# EAGLE design PulsePalSMT_Rev_0_8 (EAGLE 7.7.0)
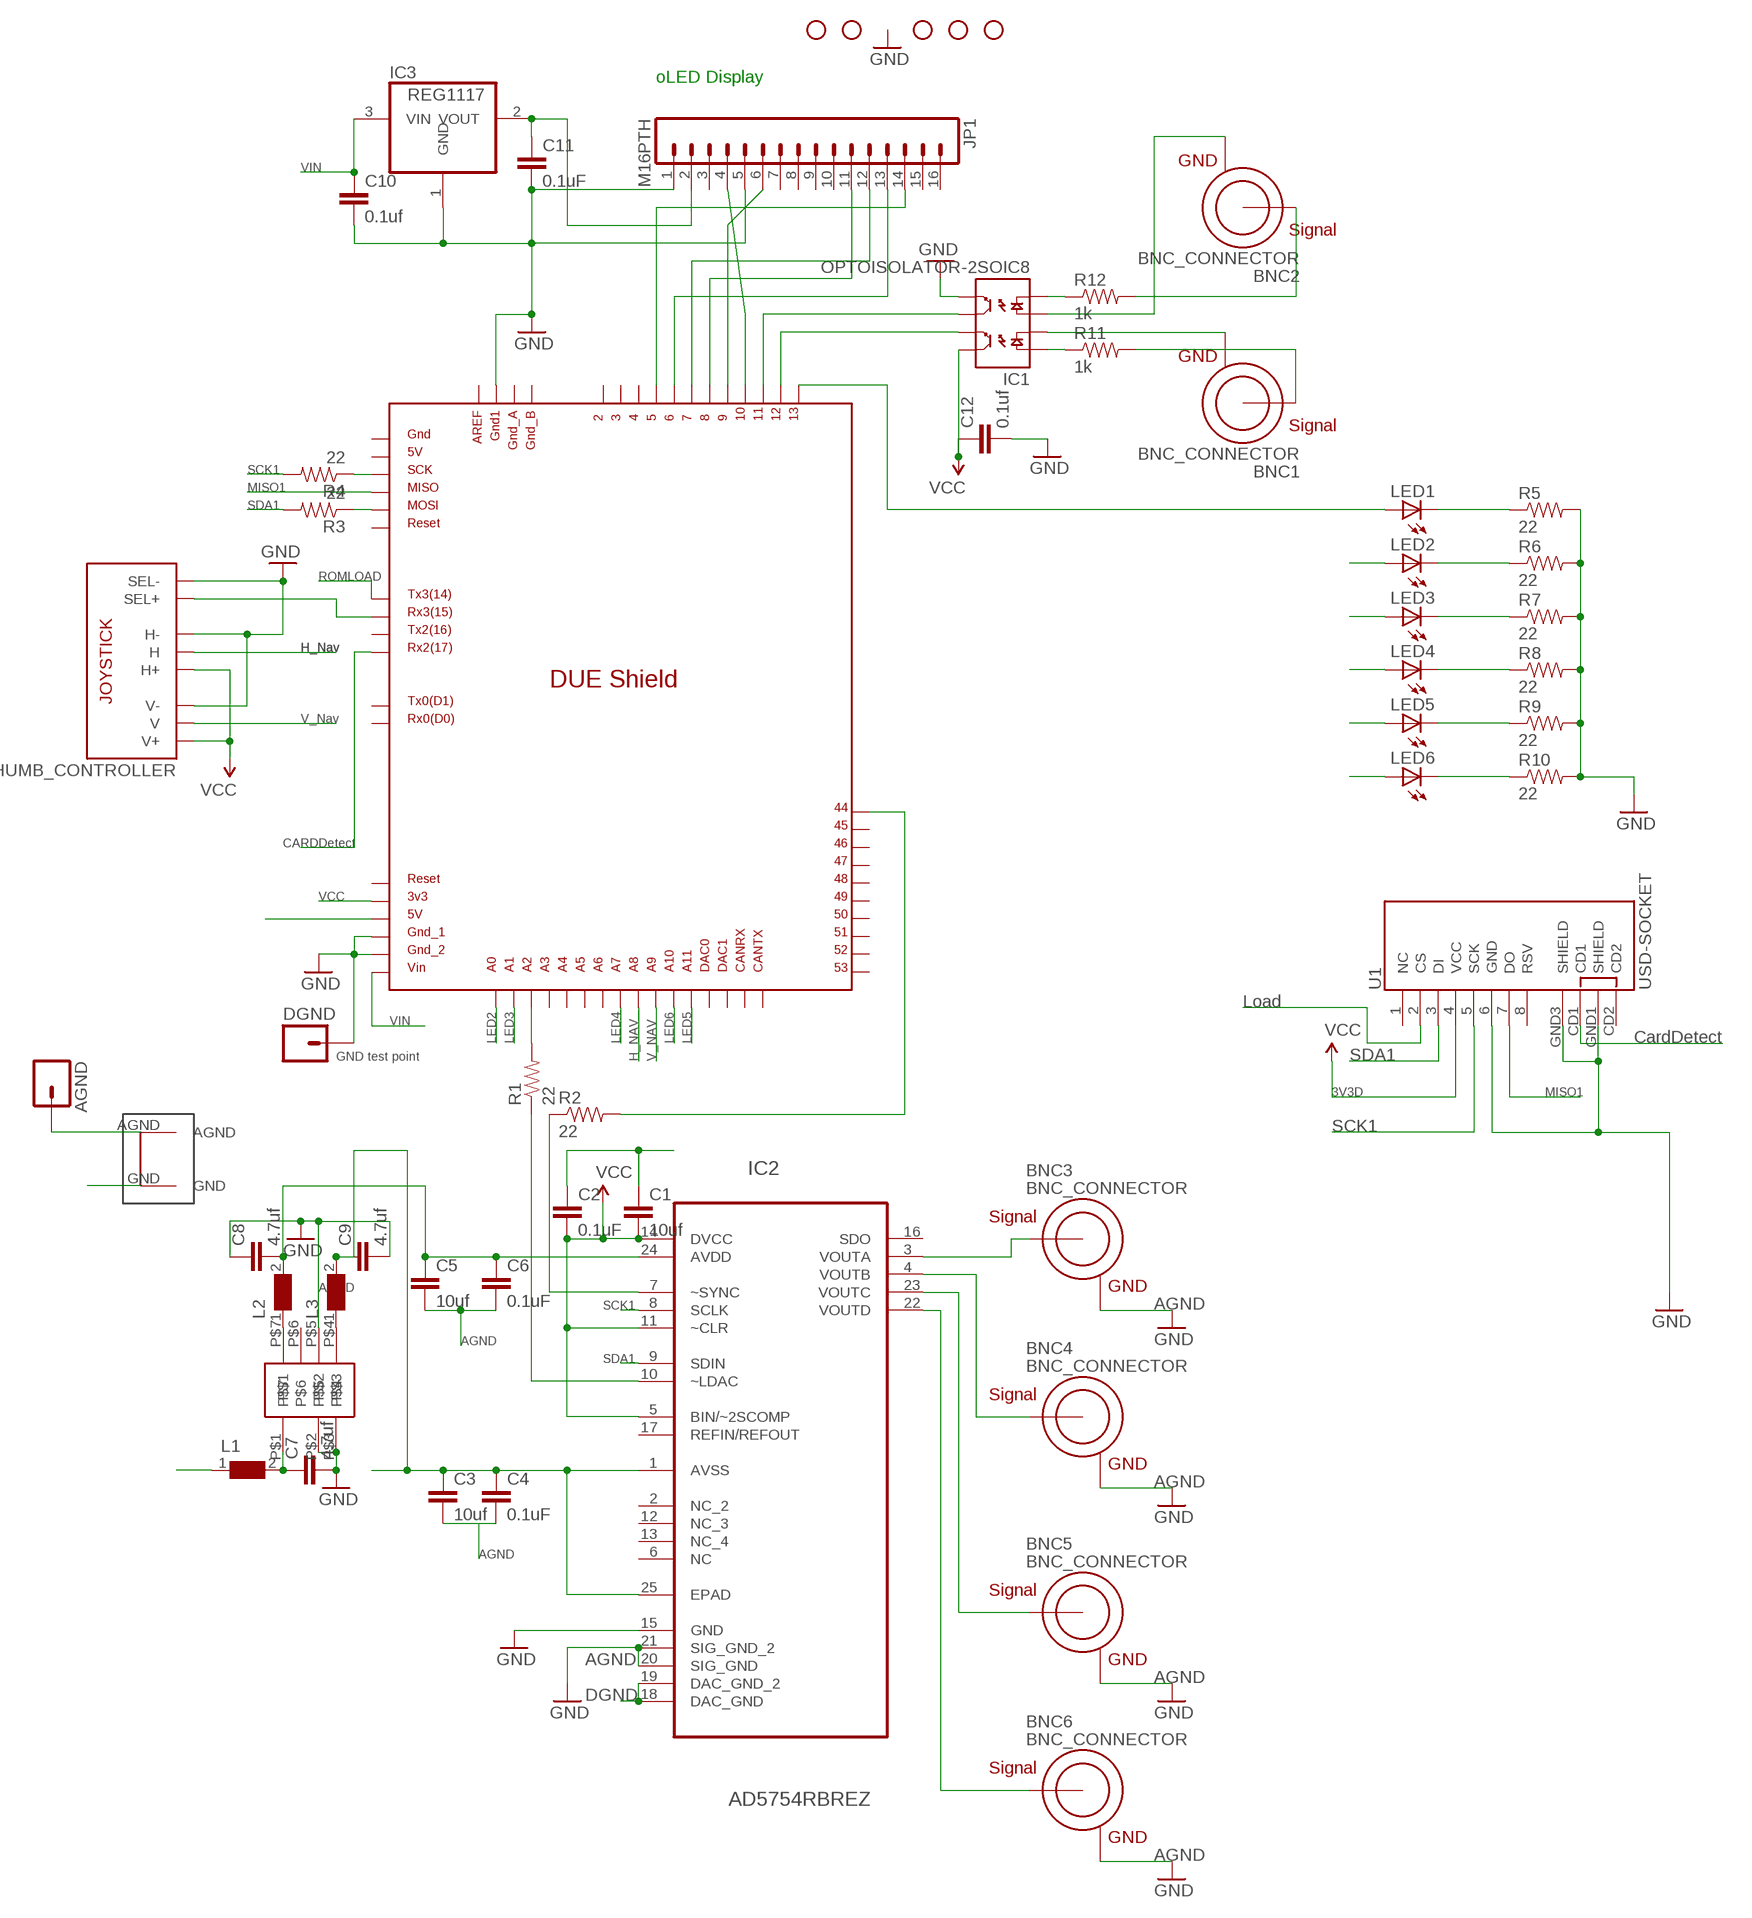
[diagram p0: schematic, sheet 1]

## Parts
AGND  M01PTH  [1X01]
ARDUINO  DUE(NORMAL)  [DUE(NORMAL)]
BNC1  BNC_CONNECTOR  [BNC_CONNECTOR]
BNC2  BNC_CONNECTOR  [BNC_CONNECTOR]
BNC3  BNC_CONNECTOR  [BNC_CONNECTOR]
BNC4  BNC_CONNECTOR  [BNC_CONNECTOR]
BNC5  BNC_CONNECTOR  [BNC_CONNECTOR]
BNC6  BNC_CONNECTOR  [BNC_CONNECTOR]
C1  10uf  CAP1206  [1206@1]
C2  0.1uF  1.0UF-0805-25V-10%  [0805]
C3  10uf  CAP1206  [1206@1]
C4  0.1uF  1.0UF-0805-25V-10%  [0805]
C5  10uf  CAP1206  [1206@1]
C6  0.1uF  1.0UF-0805-25V-10%  [0805]
C7  4.7uf  CAP1206  [1206@1]
C8  4.7uf  CAP1206  [1206@1]
C9  4.7uf  CAP1206  [1206@1]
C10  0.1uf  1.0UF-0805-25V-10%  [0805]
C11  0.1uF  1.0UF-0805-25V-10%  [0805]
C12  0.1uf  CAP1206  [1206@1]
DGND  M01PTH  [1X01]
IC1  OPTOISOLATOR-2SOIC8  [SO08-2]
IC2  AD5754RBREZ  [SOP65P640X120-25N]
IC3  REG1117  [SOT223]
JP1  M16PTH  [1X16]
JP2  STAND-OFF  [STAND-OFF]
JP5  STAND-OFF  [STAND-OFF]
JP6  STAND-OFF  [STAND-OFF]
JP8  STAND-OFF  [STAND-OFF]
JP9  STAND-OFF  [STAND-OFF]
L1  WE-CBF-742792118_1206  [1206]
L2  WE-CBF-742792118_1206  [1206]
L3  WE-CBF-742792118_1206  [1206]
LED1  LEDCHIPLED_1206  [CHIPLED_1206]
LED2  LEDCHIPLED_1206  [CHIPLED_1206]
LED3  LEDCHIPLED_1206  [CHIPLED_1206]
LED4  LEDCHIPLED_1206  [CHIPLED_1206]
LED5  LEDCHIPLED_1206  [CHIPLED_1206]
LED6  LEDCHIPLED_1206  [CHIPLED_1206]
R1  22  RESISTOR1206  [1206]
R2  22  RESISTOR1206  [1206]
R3  22  RESISTOR1206  [1206]
R4  22  RESISTOR1206  [1206]
R5  22  RESISTOR1206  [1206]
R6  22  RESISTOR1206  [1206]
R7  22  RESISTOR1206  [1206]
R8  22  RESISTOR1206  [1206]
R9  22  RESISTOR1206  [1206]
R10  22  RESISTOR1206  [1206]
R11  1k  RESISTOR1206  [1206]
R12  1k  RESISTOR1206  [1206]
THUMB_CONTROLLER  JOYSTICKPTH  [JOYSTICK]
U1  USD-SOCKET  [MICROSD_1:1]
U2  TDK_LAMBDA_5_TO_BI_12_125MA  [TDK_LAMBDA_5_TO_BI_12_125MA]
U$6  GNDPLANESHRT  [GNDPLANESHRT]

## Nets
5V: ARDUINO.5V C1.2 C2.2 IC2.5(BIN/~2SCOMP) IC2.11(~CLR) IC2.14(DVCC) L1.1 ; supply symbol labelled VCC
AGND: AGND.1 BNC3.GND BNC4.GND BNC5.GND BNC6.GND C3.2 C4.2 C5.2 C6.2 IC2.15(GND) IC2.18(DAC_GND) IC2.19(DAC_GND_2) IC2.20(SIG_GND) IC2.21(SIG_GND_2) U$6.AGND ; supply symbol labelled GND
CARDDETECT: ARDUINO.RX2 U1.CD1
GND: ARDUINO.GND1 ARDUINO.GND_1 ARDUINO.GND_2 C1.1 C2.1 C7.2 C8.1 C9.2 C10.2 C11.2 C12.2 DGND.1 IC1.5(EM2) IC3.1(GND) JP1.1 JP1.5 R5.2 R6.2 R7.2 R8.2 R9.2 R10.2 THUMB_CONTROLLER.B2A(SEL-) THUMB_CONTROLLER.H3(H-) THUMB_CONTROLLER.V3(V-) U1.6(GND) U1.GND1(SHIELD) U1.GND3(SHIELD) U2.P$2 U2.P$3 U2.P$5 U$6.GND
H_NAV: ARDUINO.A8 THUMB_CONTROLLER.H2(H)
LED2: ARDUINO.A0 LED2.A
LED3: ARDUINO.A1 LED3.A
LED4: ARDUINO.A7 LED4.A
LED5: ARDUINO.A11 LED5.A
LED6: ARDUINO.A10 LED6.A
MISO1: ARDUINO.MISO_ICSP U1.7(DO)
N$1: L2.1 U2.P$7
N$2: L3.1 U2.P$4
N$3: BNC3.SIGNAL IC2.3(VOUTA)
N$4: BNC4.SIGNAL IC2.4(VOUTB)
N$5: BNC5.SIGNAL IC2.23(VOUTC)
N$6: BNC6.SIGNAL IC2.22(VOUTD)
N$7: BNC1.GND IC1.2(C1)
N$8: BNC1.SIGNAL R11.2
N$9: BNC2.GND IC1.3(A2)
N$10: BNC2.SIGNAL R12.2
N$11: ARDUINO.SCK_ICSP R4.1
N$12: ARDUINO.MOSI_ICSP R3.1
N$13: ARDUINO.44 R2.2
N$14: ARDUINO.A2 R1.2
N$15: IC2.7(~SYNC) R2.1
N$16: IC2.10(~LDAC) R1.1
N$17: ARDUINO.RX3 THUMB_CONTROLLER.B1A(SEL+)
N$18: ARDUINO.11 IC1.6(CL2)
N$20: C11.1 IC3.2(VOUT) JP1.2
N$21: LED1.C R5.1
N$22: LED2.C R6.1
N$23: LED3.C R7.1
N$24: LED4.C R8.1
N$25: LED5.C R9.1
N$26: LED6.C R10.1
N$27: IC1.1(A1) R11.1
N$28: IC1.4(C2) R12.1
N$29: ARDUINO.12 IC1.7(EM1)
N$30: ARDUINO.5 JP1.14
N$31: ARDUINO.13 LED1.A
N$32: ARDUINO.10 JP1.4
N$33: ARDUINO.9 JP1.6
N$34: ARDUINO.8 JP1.11
N$35: ARDUINO.7 JP1.12
N$36: ARDUINO.6 JP1.13
N$39: C5.1 C6.1 C8.2 IC2.24(AVDD) L2.2
N$40: C3.1 C4.1 C9.1 IC2.1(AVSS) IC2.25(EPAD) L3.2
N$41: C7.1 L1.2 U2.P$1
ROMLOAD: ARDUINO.TX3 U1.2(CS)
SCK1: IC2.8(SCLK) R4.2 U1.5(SCK)
SDA1: IC2.9(SDIN) R3.2 U1.3(DI)
V_NAV: ARDUINO.A9 THUMB_CONTROLLER.V2(V)
VCC: ARDUINO.3V3 C12.1 IC1.8(CL1) THUMB_CONTROLLER.H1(H+) THUMB_CONTROLLER.V1(V+) U1.4(VCC)
VIN: ARDUINO.VIN C10.1 IC3.3(VIN)
Unconnected: ARDUINO.2 ARDUINO.3 ARDUINO.4 ARDUINO.5V_ICSP ARDUINO.45 ARDUINO.46 ARDUINO.47 ARDUINO.48 ARDUINO.49 ARDUINO.50 ARDUINO.51 ARDUINO.52 ARDUINO.53 ARDUINO.A3 ARDUINO.A4 ARDUINO.A5 ARDUINO.A6 ARDUINO.AREF ARDUINO.CANRX ARDUINO.CANTX ARDUINO.DAC0 ARDUINO.DAC1 ARDUINO.GND_A ARDUINO.GND_B ARDUINO.GND_ICSP ARDUINO.RESET ARDUINO.RESET_ICSP ARDUINO.RX0 ARDUINO.TX0 ARDUINO.TX2 IC2.2(NC_2) IC2.6(NC) IC2.12(NC_3) IC2.13(NC_4) IC2.16(SDO) IC2.17(REFIN/REFOUT) JP1.3 JP1.7 JP1.8 JP1.9 JP1.10 JP1.15 JP1.16 U1.1(NC) U1.8(RSV) U1.CD2 U2.P$6

## Notes on the sheet
- oLED Display
- VIN
- SCK1
- MISO1
- SDA1
- ROMLOAD
- H_Nav | H_Nav
- V_Nav
- CARDDetect
- VCC
- Load
- VIN
- LED2 | LED3 | LED4 | LED6 | LED5 | CardDetect
- GND test point | H_NAV | V_NAV | SDA1
- 3V3D | MISO1
- SCK1
- AGND
- SCK1 | AGND
- AGND
- SDA1
- AGND
- AGND
- AGND
- AGND
- DGND
- AGND

## Library data of the parts
AGND DGND = SparkFun-Connectors:M01: Header 1 Standard 1-pin 0.1" header. Use with straight break away headers (SKU : PRT-00116), right angle break away headers (PRT-00553), swiss pins (PRT-00743), machine pins (PRT-00117), and female headers (PRT-00115).
ARDUINO = DUElib130425_JS2:DUE(NORMAL)
BNC1-BNC6 = JoshParts:BNC_CONNECTOR
C1 C3 C5 C7-C9 C12 = SparkFun-Capacitors:CAP: Capacitor Standard 0603 ceramic capacitor, and 0.1" leaded capacitor.
C2 C4 C6 C10 C11 = SparkFun-Capacitors:1.0UF: 1µF ceramic capacitors A capacitor is a passive two-terminal electrical component used to store electrical energy temporarily in an electric field.; PROD_ID: CAP-08064; VALUE: 1.0uF
IC1 = SparkFun-DiscreteSemi:OPTOISOLATOR-2: Description: Dual gate opto isolator. Vishay part : ILD213T; PROD_ID: IC-09076
IC2 = Analog Devices_By_element14_Batch_1:AD5754RBREZ: DAC; MPN: AD5754RBREZ; OC_FARNELL: 1786050; OC_NEWARK: 51P3755; PACKAGE: TSSOP-24; SUPPLIER: Analog Devices
IC3 = burr-brown:REG1117: 800mA and 1A Low Dropout (LDO) Positive Regulator 1.8V, 2.5V, 2.85V, 3.3V, 5V, and Adj; MPN: REG1117; OC_FARNELL: 1097566; OC_NEWARK: 14P6981
JP1 = SparkFun:M16
JP2 JP5 JP6 JP8 JP9 = SparkFun:STAND-OFF: Stand Off This is the mechanical footprint for a #4 phillips button head screw. Use the keepout ring to avoid running the screw head into surrounding components. SKU : PRT-00447
L1-L3 = WE-CBF:WE-CBF: SMD EMI Suppression Ferrite Beads WE-CBF - Excellent anti-EMI properties - Low DC-restistance - Impedances till 3000 ohms - Rated current up to 6 A -- Reliable Ni-Sn electrodes -- Perfect as data lined filter and for uncoupling of distribution voltage; MPN: 742792118; OC_FARNELL: 1800374; OC_NEWARK: 78R5648; PACKAGE: IND-1206; SUPPLIER: Wuerth Elektronik
LED1-LED6 = led:LED: LED OSRAM: - CHIPLED LG R971, LG N971, LY N971, LG Q971, LY Q971, LO R971, LY R971 LH N974, LH R974 LS Q976, LO Q976, LY Q976 LO Q996 - Hyper CHIPLED LW Q18S LB Q993, LB Q99A, LB R99A - SideLED LS A670, LO A670, LY A670, LG A670, LP A670 LB A673, LV A673, LT A673, LW A673 LH A674 LY A675 LS A676, LA A676, LO A676, LY A676, LW A676 LS A679, LY A679, LG A679 - Hyper Micro SIDELED® LS Y876, LA Y876, LO Y876, LY Y876 LT Y87S - SmartLED LW L88C, LW L88S LB L89C, LB L89S, LG L890 LS L89K, LO L89K, LY L89K LS L896, LA L896, LO L896, LY L896 - TOPLED LS T670, LO T670, LY T670, LG T670, LP T670 LSG T670, LSP T670, LSY T670, LOP T670, LYG T670 LG T671, LOG T671, LSG T671 LB T673, LV T673, LT T673, LW T673 LH T674 LS T676, LA T676, LO T676, LY T676, LB T676, LH T676, LSB T676, LW T676 LB T67C, LV T67C, LT T67C, LS T67K, LO T67K, LY T67K, LW E67C LS E67B, LA E67B, LO E67B, LY E67B, LB E67C, LV E67C, LT E67C LW T67C LS T679, LY T679, LG T679 LS T770, LO T770, LY T770, LG T770, LP T770 LB T773, LV T773, LT T773, LW T773 LH T774 LS E675, LA E675, LY E675, LS T675 LS T776, LA T776, LO T776, LY T776, LB T776 LHGB T686 LT T68C, LB T68C - Hyper Mini TOPLED® LB M676 - Mini TOPLED Santana® LG M470 LS M47K, LO M47K, LY M47K Source: http://www.osram.convergy.de LUXEON: - LUMILED® LXK2-PW12-R00, LXK2-PW12-S00, LXK2-PW14-U00, LXK2-PW14-V00 LXK2-PM12-R00, LXK2-PM12-S00, LXK2-PM14-U00 LXK2-PE12-Q00, LXK2-PE12-R00, LXK2-PE12-S00, LXK2-PE14-T00, LXK2-PE14-U00 LXK2-PB12-K00, LXK2-PB12-L00, LXK2-PB12-M00, LXK2-PB14-N00, LXK2-PB14-P00, LXK2-PB14-Q00 LXK2-PR12-L00, LXK2-PR12-M00, LXK2-PR14-Q00, LXK2-PR14-R00 LXK2-PD12-Q00, LXK2-PD12-R00, LXK2-PD12-S00 LXK2-PH12-R00, LXK2-PH12-S00 LXK2-PL12-P00, LXK2-PL12-Q00, LXK2-PL12-R00 Source: www.luxeon.com KINGBRIGHT: KA-3528ASYC Source: www.kingbright.com
R1-R4 R11 R12 = SparkFun-Resistors:RESISTOR: Resistor Basic schematic elements and footprints for 0603, 1206, and PTH resistors.
R5-R10 = SparkFun:RESISTOR: Resistor Basic schematic elements and footprints for 0603, 1206, and PTH resistors.
THUMB_CONTROLLER = SparkFun:JOYSTICK: Thumb Joystick Joystick commonly found in PS2 controllers. Two pots and a select switch. Footprint proven. Spark Fun Electronics SKU : COM-09032
U1 = SparkFun-Connectors:USD-SOCKET: microSD Socket Push-push type uSD socket. Schematic element and footprint production proven. Spark Fun Electronics SKU : PRT-00127. tDoc lines correctly indicate media card edge positions when inserting (unlocked, locked, depressed). NOTE: CD1 and CD2 are connected internally; PROD_ID: CONN-07820
U2 = JoshParts:TDK_LAMBDA_5_TO_BI_12_125MA
U$6 = Joshparts2:GNDPLANESHRT

## Net classes
0 default: width 0.203 mm
1 vcc: width 0.254 mm

## Board
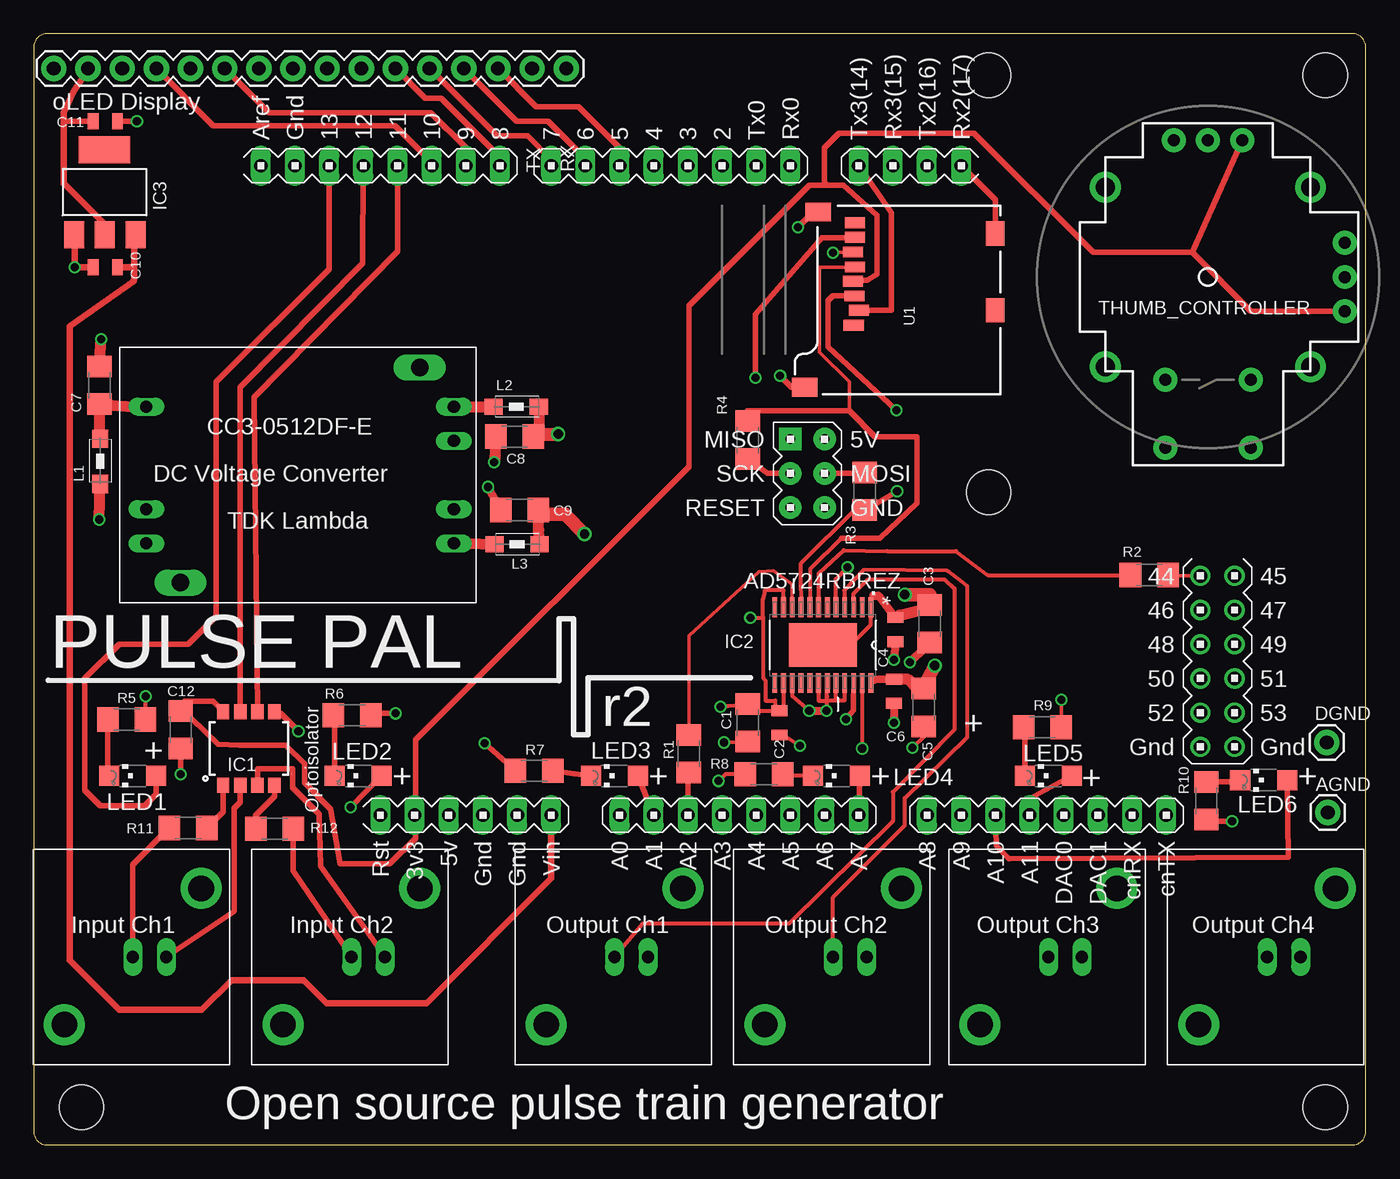
[diagram p1: board, top side]
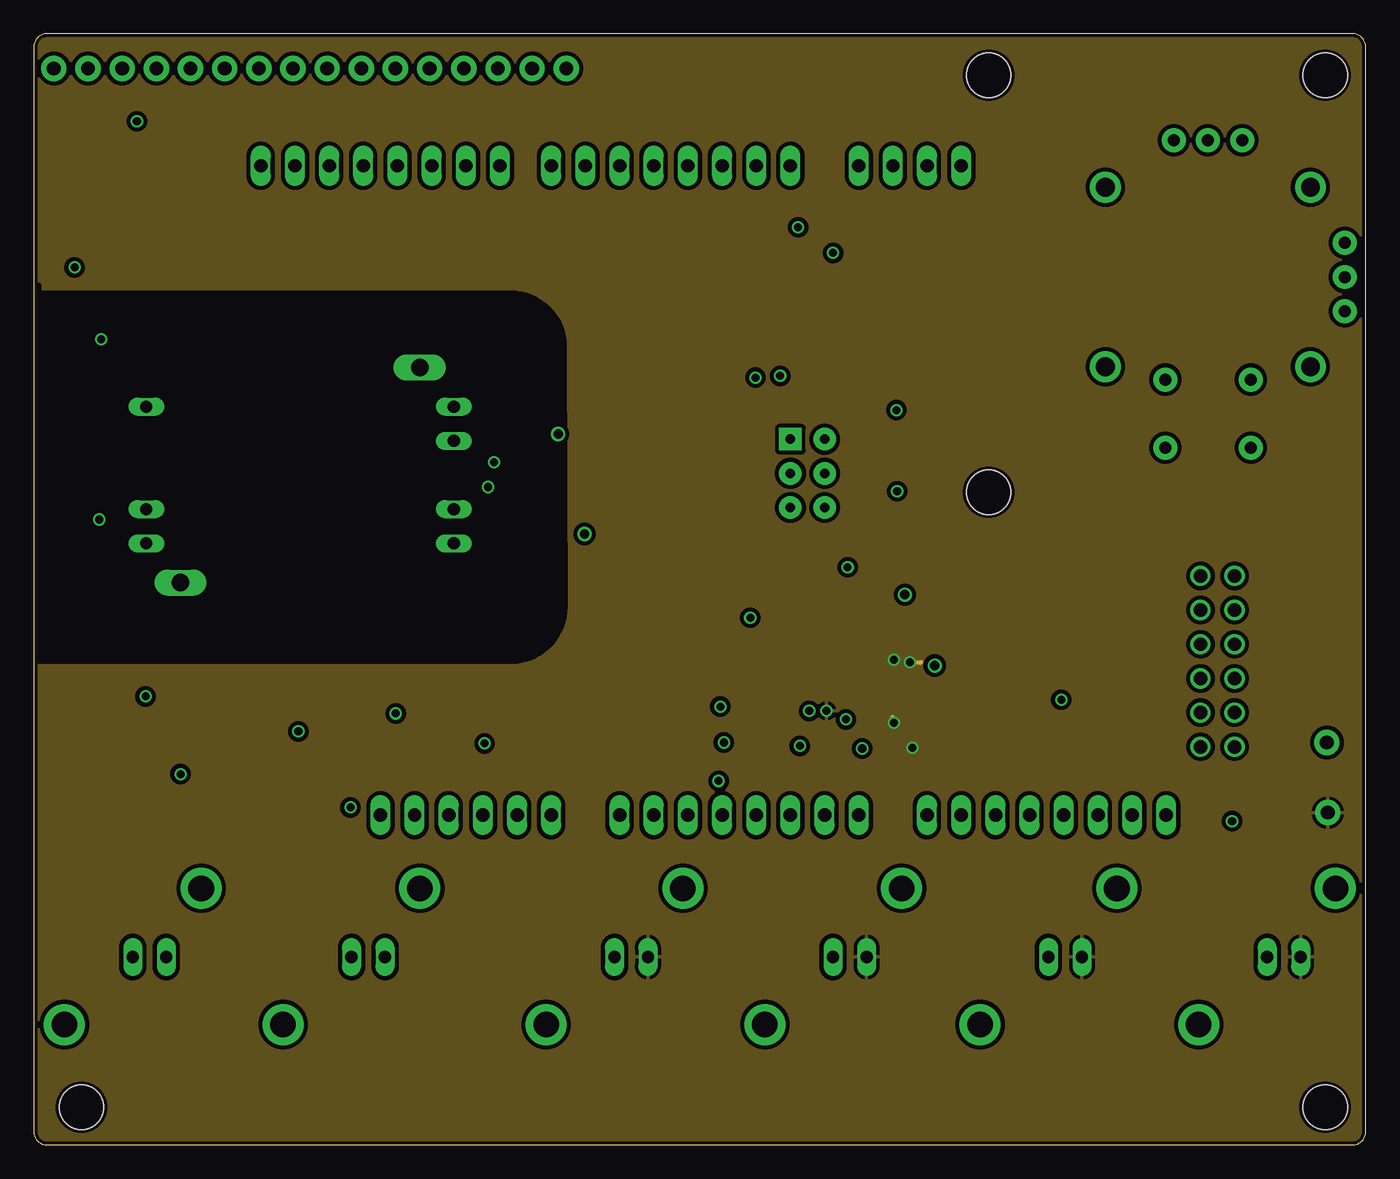
[diagram p2: board, inner layer Route2]
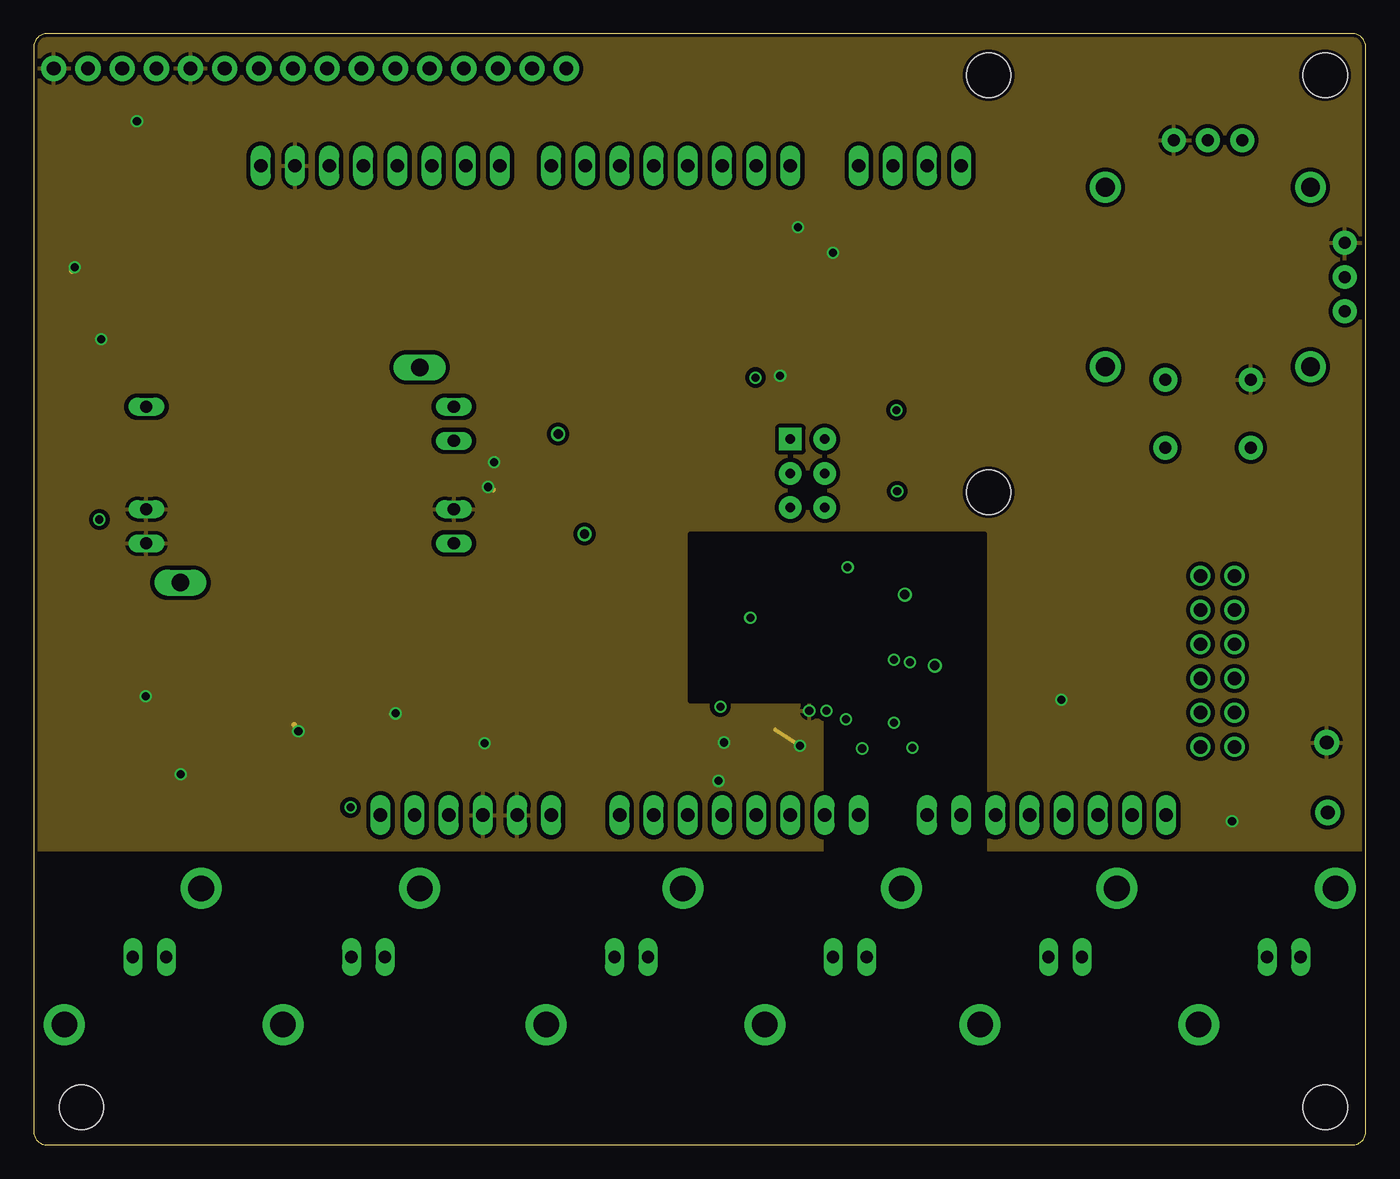
[diagram p3: board, inner layer Route15]
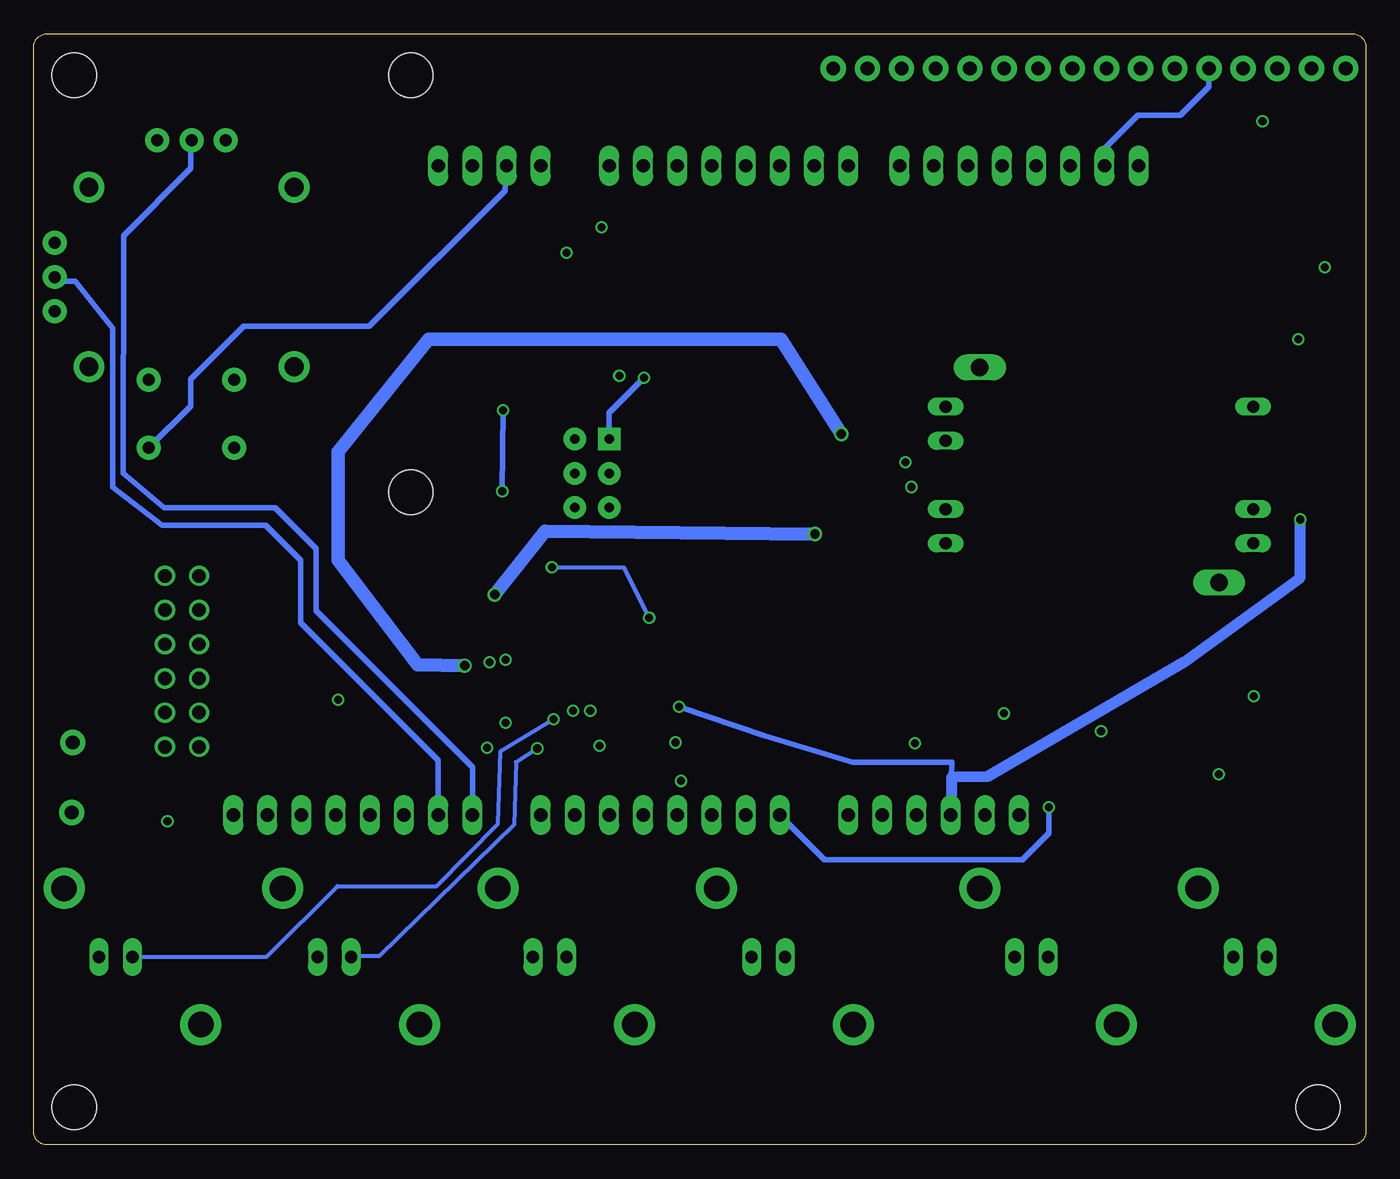
[diagram p4: board, bottom side, seen from below]

Size 99.04 x 82.59 mm. Coordinates in mm from the lower left corner, seen from the top.
Outline: 0,81.59 0,1 arc90 1,0 98.04,0 arc90 99.04,1 99.04,81.59 arc90 98.04,82.59 1,82.59 arc90 0,81.59
Copper layers (1*2*15*16): Top 0.035mm / dielectric 0.2mm / Route2 0.0175mm / dielectric 0.3mm / Route15 0.0175mm / dielectric 0.2mm / Bottom 0.035mm
Design rules "SeeedStudio_4layer_DRU_no_angle_20140221 *": minimum track width 8mil, minimum drill 12mil, track to track 12mil, track to pad 12mil, pad to pad 12mil, via to via 12mil, smd to smd 0mil, copper to edge 10mil, drill to drill 8mil, minimum pad ring 6mil, minimum via ring 4mil, stop-mask expansion 4mil, vias tented up to drill 25mil, thermal gap 10mil

### Footprints (pad centres in the part's own frame; a part is rotated, then mirrored left to right if it is on the bottom)
1X01 = drill 1.016 pad 1.88: 1 0,0
DUE(NORMAL) = drill 1 long: 2 -16.51,30.48; 3 -19.05,30.48; 3V3 -39.37,-17.78; 4 -21.59,30.48; 5 -24.13,30.48; 5V -36.83,-17.78; 6 -26.67,30.48; 7 -29.21,30.48; 8 -33.02,30.48; 9 -35.56,30.48; 10 -38.1,30.48; 11 -40.64,30.48; 12 -43.18,30.48; 13 -45.72,30.48; A0 -24.13,-17.78; A1 -21.59,-17.78; A2 -19.05,-17.78; A3 -16.51,-17.78; A4 -13.97,-17.78; A5 -11.43,-17.78; A6 -8.89,-17.78; A7 -6.35,-17.78; A8 -1.27,-17.78; A9 1.27,-17.78; A10 3.81,-17.78; A11 6.35,-17.78; AREF -50.8,30.48; CANRX 13.97,-17.78; CANTX 16.51,-17.78; DAC0 8.89,-17.78; DAC1 11.43,-17.78; GND1 -48.26,30.48; GND_1 -34.29,-17.78; GND_2 -31.75,-17.78; RESET -41.91,-17.78; RX0 -11.43,30.48; RX2 1.27,30.48; RX3 -3.81,30.48; TX0 -13.97,30.48; TX2 -1.27,30.48; TX3 -6.35,30.48; VIN -29.21,-17.78 | drill 0.7 pad 1.676: 5V_ICSP -8.89,5.08; GND_ICSP -8.89,10.16; MOSI_ICSP -8.89,7.62; RESET_ICSP -11.43,5.08; SCK_ICSP -11.43,7.62 | drill 1: 44 19.05,0; 45 21.59,0; 46 19.05,-2.54; 47 21.59,-2.54; 48 19.05,-5.08; 49 21.59,-5.08; 50 19.05,-7.62; 51 21.59,-7.62; 52 19.05,-10.16; 53 21.59,-10.16; GND_A 19.05,-12.7; GND_B 21.59,-12.7 | drill 0.7 pad 1.676 square: MISO_ICSP -11.43,10.16
BNC_CONNECTOR = drill 0.9 pad 1.422 long: GND -2.492,0; SIGNAL 0,0 | drill 1.9 pad 3.048: P$3 5.076,5.025; P$4 -5.089,-5.102
1206@1 = smd 1.6 x 1.8: 1 -1.4,0; 2 1.4,0
0805 = smd 0.8 x 1.2: 1 -0.9,0; 2 0.9,0
SO08-2 = smd 0.914 x 1.143: 1 -1.905,-2.731; 2 -0.635,-2.731; 3 0.635,-2.731; 4 1.905,-2.731; 5 1.905,2.731; 6 0.635,2.731; 7 -0.635,2.731; 8 -1.905,2.731
SOP65P640X120-25N = smd 1.473 x 0.356: 1 -2.819,3.581; 2 -2.819,2.921; 3 -2.819,2.286; 4 -2.819,1.626; 5 -2.819,0.965; 6 -2.819,0.33; 7 -2.819,-0.33; 8 -2.819,-0.965; 9 -2.819,-1.626; 10 -2.819,-2.286; 11 -2.819,-2.921; 12 -2.819,-3.581; 13 2.819,-3.581; 14 2.819,-2.921; 15 2.819,-2.286; 16 2.819,-1.626; 17 2.819,-0.965; 18 2.819,-0.33; 19 2.819,0.33; 20 2.819,0.965; 21 2.819,1.626; 22 2.819,2.286; 23 2.819,2.921; 24 2.819,3.581 | smd 3.251 x 5.029: 25 0,0
SOT223 = smd 1.499 x 2.007: 1 -2.261,-3.15; 2 0.025,-3.15; 3 2.311,-3.15 | smd 3.81 x 2.007: 4 0,3.15
1X16 = drill 1.016 pad 1.88: 1 0,0; 2 2.54,0; 3 5.08,0; 4 7.62,0; 5 10.16,0; 6 12.7,0; 7 15.24,0; 8 17.78,0; 9 20.32,0; 10 22.86,0; 11 25.4,0; 12 27.94,0; 13 30.48,0; 14 33.02,0; 15 35.56,0; 16 38.1,0
STAND-OFF = hole 3.302: 0,0
1206 = smd 1.35 x 1.2: 1 -1.675,0; 2 1.675,0
CHIPLED_1206 = smd 1.5 x 1.5: A 0,-1.75; C 0,1.75
1206' = smd 1.6 x 1.8: 1 -1.4,0; 2 1.4,0
JOYSTICK = drill 0.9 pad 1.778: B1A -3.175,12.7; B1B 3.175,12.7; B2A -3.175,7.62; B2B 3.175,7.62 | drill 0.889 pad 1.778: H1 -2.54,-10.16; H2 0,-10.16; H3 2.54,-10.16; V1 -10.16,2.54; V2 -10.16,0; V3 -10.16,-2.54 | drill 1.397 pad 2.286: MOUNT1 -7.62,6.668; MOUNT2 -7.62,-6.668; MOUNT3 7.62,-6.668; MOUNT4 7.62,6.668
MICROSD_1:1 = smd 0.8 x 1.5: 1 5.096,10.919; 2 6.218,10.519; 3 7.274,10.853; 4 8.367,10.982; 5 9.421,10.828; 6 10.539,10.973; 7 11.648,10.819; 8 12.721,10.819 | smd 1.8 x 1.4: CD1 11.92,0.4; CD2 6.22,0.4 | smd 1.4 x 1.9: GND1 0.497,14.55; GND3 13.52,13.55
TDK_LAMBDA_5_TO_BI_12_125MA = drill 0.9 long: P$1 0,-2.92; P$2 0,-10.54; P$3 0,-13.08; P$4 22.86,-13.08; P$5 22.86,-10.54; P$6 22.86,-5.46; P$7 22.86,-2.92 | drill 1.3 long: P$8 20.32,0; P$9 2.54,-16
GNDPLANESHRT = drill 0.6: AGND -1.27,0; GND 0,0

### Placement (x,y rotation side)
AGND  96.2,24.7 0 top
ARDUINO  67.69,42.29 0 top
BNC1  7.37,13.97 180 top
BNC2  23.62,13.97 180 top
BNC3  43.18,13.97 180 top
BNC4  59.44,13.97 180 top
BNC5  75.44,13.97 180 top
BNC6  91.69,13.97 180 top
C1  53.09,31.37 90 top
C2  55.44,31.37 90 top
C3  66.61,38.73 270 top
C4  64.07,38.29 270 top
C5  66.17,32.51 270 top
C6  63.94,33.72 270 top
C7  4.89,56.45 90 top
C8  35.75,52.64 0 top
C9  36.13,47.18 180 top
C10  5.33,65.21 180 top
C11  5.33,76.07 0 top
C12  10.92,30.86 270 top
DGND  96.14,29.91 0 top
IC1  16,29.46 0 top
IC2  58.67,37.15 270 top
IC3  5.27,70.8 0 top
JP1  1.5,80 0 top
JP2  71,79.5 0 top
JP5  96.01,2.79 0 top
JP6  96.01,79.5 0 top
JP8  71,48.5 0 top
JP9  3.56,2.79 0 top
L1  4.95,50.8 90 top
L2  35.88,54.86 0 top
L3  35.94,44.64 0 top
LED1  7.37,27.43 90 top
LED2  24.13,27.43 90 top
LED3  43.18,27.43 90 top
LED4  59.69,27.43 90 top
LED5  75.44,27.43 90 top
LED6  91.44,27.11 90 top
R1  22  [1206']  48.7,29.08 270 top
R2  22  [1206']  82.93,42.35 0 top
R3  22  [1206']  61.79,48.58 270 top
R4  22  [1206']  53.09,52.39 90 top
R5  22  [1206']  6.92,31.62 0 top
R6  22  [1206']  23.69,31.94 0 top
R7  22  [1206']  37.21,27.81 180 top
R8  22  [1206']  54.29,27.56 180 top
R9  22  [1206']  74.99,31.05 0 top
R10  22  [1206']  87.19,25.59 270 top
R11  1k  [1206']  11.49,23.56 180 top
R12  1k  [1206']  17.91,23.5 0 top
THUMB_CONTROLLER  87.3,64.5 180 top
U1  71.88,55.82 90 top
U2  8.38,57.78 0 top
U$6  57.66,32.26 180 top

### Tracks (layer width: path | path; a pad name or v marks a point on that pad's centre or on a via)
5V  (via drill 0.6)
  Top 0.3: v51.05,32.58 51.63,32.64 C1.2 53.06,32.26 C2.2 | IC2.11 55.75,41.21 54.36,41.21 54.23,40.58 54.23,39.18 | IC2.5 59.64,42.05 v60.52,42.93 | v53.28,39.18 54.23,39.18 | 54.23,39.18 54.23,34.73 54.42,34.48 54.42,33.02 55.12,33.02 55.12,32.27 C2.2 | IC2.14 55.75,32.27 C2.2
  Top 0.8: v4.89,46.48 L1.1
  Bottom 0.3: v60.52,42.93 55.18,42.93 v53.28,39.18
  Bottom 0.4: 30.99,24.51 ARDUINO.5V 30.92,24.51 | v51.05,32.58 44.7,30.42 38.16,28.45 30.78,28.44 30.8,27.32
  Bottom 0.8: v4.89,46.48 4.89,42.16 13.53,35.88 28.13,27.37 30.8,27.32 ARDUINO.5V
AGND  (via drill 0.6)
  Top 0.25: 58.99,34.31 IC2.19
  Top 0.3: U$6.AGND 58.98,33.05 | 58.98,33.05 58.99,33.34 58.99,34.31 | IC2.15 56.39,33.4 57.66,32.26 | C5.2 66.17,30.35 v65.34,29.53 | IC2.18 58.36,34.33 58.36,33.02 58.98,33.02 | IC2.20 59.63,34.33 59.63,33.02 | 59.63,33.02 58.98,33.02 | 58.98,33.02 58.98,33.05 | IC2.21 60.26,34.33 60.26,33.02 59.63,33.02
  Top 0.6: 57.66,32.26 U$6.AGND | C6.2 v63.94,31.37 | C3.2 66.17,36.89 v65.15,35.88 | C4.2 v63.94,36.07
  Route2 0.3: 63.88,31.81 v63.94,31.37 | v65.34,29.53 65.34,29.46 65.15,29.27 | v65.15,35.88 65.98,35.88 65.91,35.81 | v63.94,36.07 64.07,36.01 64.14,35.88
  pour Route2: -0.06,82.55 0,1 arc90 1,0 98.06,0 arc90 99.06,1 99,82.55
CARDDETECT
  Top 0.4: U1.CD1 71.48,70.25 ARDUINO.RX2
GND  (via drill 0.6)
  Top 0.25: R9.2 v76.39,33.08 | U1.6 59.5,66.36 v59.44,66.29
  Top 0.3: R5.2 v8.32,33.34 | C1.1 51.63,29.91 v51.31,29.91 | C2.1 55.63,30.54 v56.96,29.65 | R8.2 51.44,27.56 v50.93,27.05
  Top 0.4: R6.2 25.21,32.07 v26.92,32.07 | IC1.5 17.97,32.07 | C9.2 | R7.2 v33.53,29.84 | U1.GND3 57.97,69.34 v56.83,68.2 | U1.GND1 56.34,56.31 v55.5,57.15 | R10.2 87.31,24.07 v89.09,24.07 | C11.2 v7.68,76.07
  Top 0.406: C12.2 v10.92,27.56 | 17.97,32.07 18.35,32.07 v19.68,30.73
  Top 0.5: IC3.1 3.05,67.65 v3.05,65.22 C10.2
  Top 0.6: C9.2 v33.78,48.9
  Top 0.8: C7.2 v5.02,59.88 | C8.1 34.29,51.18 v34.23,50.74
  Route15 0.25: v76.39,33.08 76.39,33.02 | v59.44,66.29 59.37,66.29
  Route15 0.3: v51.31,29.91 51.24,29.97 | v56.96,29.65 55.31,30.73 55.12,30.86 | v50.93,27.05 50.86,27.05 50.8,26.99
  Route15 0.4: v33.78,48.9 34.16,48.7 | v34.23,50.74 34.29,50.99 | v33.53,29.84 33.53,30.1 | v26.92,32.07 27.18,32.13 26.61,32 | v19.68,30.73 19.37,31.24 | v56.83,68.2 56.71,68.07 | v55.5,57.15 55.37,57.28 | v89.09,24.07 89.34,24.07 | v7.68,76.07 7.94,76.07 7.94,76.14
  Route15 0.406: 11.18,27.43 v10.92,27.56
  Route15 0.5: v3.05,65.22 2.86,65.22 2.86,64.96
  Bottom 0.4: 19.49,73.98 19.49,72.71
  Bottom 0.406: 19.49,73.98 16.95,76.52 13.78,76.52 11.66,78.64 JP1.5
  pour Route15: 0,21.97 99.06,21.97 99.06,22.03 99,22.03 99,81.61 arc90 98,82.61 1,82.61 arc90 0,81.61
H_NAV
  Bottom 0.4: ARDUINO.A8 66.42,28.07 78.04,39.69 78.04,44.32 81.09,47.37 89.34,47.37 92.39,49.91 92.33,67.56 87.38,72.58 87.38,74.58 THUMB_CONTROLLER.H2
LED2  (via drill 0.6)
  Top 0.406: LED2.A 25.84,27.43 v23.56,25.08
  Bottom 0.406: v23.56,25.08 23.56,23.18 25.53,21.21 40.26,21.21 ARDUINO.A0
LED3
  Top 0.4: LED3.A ARDUINO.A1
LED4
  Top 0.4: LED4.A ARDUINO.A7
LED5
  Top 0.4: LED5.A 77.15,27.43 74.04,25.72 ARDUINO.A11
LED6
  Top 0.4: LED6.A 93.19,26.83 93.28,21.4 72.52,21.27 71.56,22.23 ARDUINO.A10
MISO1  (via drill 0.6)
  Top 0.25: 61.03,67.44 U1.7
  Top 0.4: v53.66,57.02 53.66,61.72 58.61,67.44 61.03,67.44
  Bottom 0.4: ARDUINO.MISO_ICSP 56.26,54.42 v53.66,57.02
N$1
  Top 0.8: U2.P$7 32.23,54.87 L2.1
N$2
  Top 0.8: U2.P$4 32.17,44.7 L3.1
N$3
  Top 0.3: IC2.3 60.96,40.96 62.04,42.04 67.69,42.04 68.45,41.34 68.45,30.86 63.88,26.23 63.88,24.07 56.13,16.45 45.28,16.45 BNC3.SIGNAL
N$4
  Top 0.3: BNC4.SIGNAL 59.44,18.41 64.77,23.75 64.77,25.78 69.41,30.29 69.41,41.53 67.94,42.67 61.72,42.74 60.26,41.21 60.26,40.01 IC2.4
N$5  (via drill 0.6)
  Top 0.3: IC2.23 v61.59,29.46
  Bottom 0.3: v61.59,29.46 63.18,28.45 63.31,23.81 73.34,14.03 75.37,14.03 BNC5.SIGNAL
N$6  (via drill 0.6)
  Top 0.3: 60.96,33.44 IC2.22
  Top 0.4: 60.96,33.44 60.96,32.32 v60.39,31.62
  Bottom 0.3: BNC6.SIGNAL 81.72,13.97 76.45,19.24 69.09,19.24 64.52,23.88 64.33,29.27 v60.39,31.62
N$7
  Top 0.4: BNC1.GND 14.86,17.34
  Top 0.406: IC1.2 15.37,25.46 14.92,25.02 14.92,17.4 14.86,17.34
N$8
  Top 0.4: BNC1.SIGNAL 7.37,20.83 R11.2
N$9
  Top 0.4: BNC2.GND 21.34,20.72 21.21,24.57
  Top 0.406: IC1.3 16.64,27.94 19.24,27.94 19.24,26.54 21.21,24.57
N$10
  Top 0.4: BNC2.SIGNAL 19.31,20.38 R12.2
N$11
  Top 0.4: R4.1 54.54,49.91 ARDUINO.SCK_ICSP
N$12
  Top 0.4: R3.1 62.1,49.91 ARDUINO.MOSI_ICSP
N$13
  Top 0.3: R2.2 ARDUINO.44
N$14
  Top 0.4: ARDUINO.A2 48.64,27.62 R1.2
N$15
  Top 0.3: IC2.7 58.36,42.46 60.22,44.2 63.44,44.13 68.58,44.13 70.93,42.35 R2.1
N$16
  Top 0.25: R1.1 48.7,37.85 53.91,42.61 54.99,42.67 56.39,41.66 IC2.10
N$17
  Bottom 0.4: ARDUINO.RX3 64.01,70.93 74.11,60.83 83.44,60.83 87.38,56.9 87.38,54.9 THUMB_CONTROLLER.B1A
N$18
  Top 0.4: IC1.6 16.38,55.56 27.05,66.42 ARDUINO.11
N$20
  Top 0.4: C11.1 2.22,76.07 2.22,76.01
  Top 0.5: JP1.2 4.13,80 2.98,78.3 2.22,76.71 2.22,76.01 2.22,71.44 2.29,71.44 5.33,68.39 5.33,67.69 IC3.2
N$21
  Top 0.4: LED1.C 5.49,27.66 R5.1
N$22
  Top 0.4: LED2.C 22.38,31.85 R6.1
N$23
  Top 0.4: LED3.C 40.16,27.6 R7.1
N$24
  Top 0.3: LED4.C 55.82,27.43 R8.1
N$25
  Top 0.4: LED5.C 73.69,30.51 R9.1
N$26
  Top 0.4: LED6.C 89.79,26.99 R10.1
N$27
  Top 0.4: 13.53,24.19 13.3,23.97 12.51,23.18 R11.1
  Top 0.406: IC1.1 14.1,24.77 13.3,23.97
N$28
  Top 0.406: R12.1 16.51,24.51 17.91,25.91 IC1.4
N$29
  Top 0.4: IC1.7 15.37,56.33 24.45,65.53 ARDUINO.12
N$30
  Top 0.4: 43.56,74.11 43.62,74.04 ARDUINO.5
  Top 0.406: JP1.14 37.37,77.15 40.51,77.15 43.56,74.11
N$31
  Top 0.4: ARDUINO.13 21.97,65.09 13.59,56.71 13.59,39.31 11.56,37.27
  Top 0.406: LED1.A 9.12,26.07 8.26,25.21 4.95,25.21 3.81,26.35 3.81,34.67 6.35,37.21 11.49,37.21 11.56,37.27
N$32
  Top 0.4: 29.59,73.03 ARDUINO.10
  Top 0.406: JP1.4 13.36,75.75 26.86,75.75 29.59,73.03
N$33
  Top 0.4: 32.13,74.11 ARDUINO.9
  Top 0.406: JP1.6 17.49,76.71 29.53,76.71 32.13,74.11
N$34
  Top 0.4: 34.67,73.41 ARDUINO.8
  Top 0.406: JP1.11 29.11,77.79 30.29,77.79 34.67,73.41
N$35
  Top 0.4: 38.48,73.22 38.54,73.15 ARDUINO.7
  Top 0.406: JP1.12 34.45,74.99 36.7,74.99 38.48,73.22
N$36
  Top 0.4: 41.02,73.28 41.08,73.22 ARDUINO.6
  Top 0.406: JP1.13 35.91,76.07 38.23,76.07 41.02,73.28
N$37
  cutout Route15: 48.83,33.02 70.68,33.02 70.68,45.4 48.83,45.4
N$38
  cutout Route15: 59.69,33.34 58.93,33.34 58.93,21.46 70.68,21.46 70.68,33.46 59.69,33.46
N$39  (via drill 0.7)
  Top 0.3: 62.5,34.57 IC2.24
  Top 0.4: 37.62,52.79 C8.2 | 66.17,34.1 C5.1
  Top 0.6: 62.5,34.57 C6.1 63.96,34.61 | C5.1 65.72,33.91
  Top 0.8: L2.2 37.62,52.79 | 65.72,33.91 65.02,34.61 63.96,34.61
  Top 1: 37.62,52.79 v38.99,52.83 | v66.99,35.62 66.17,34.1
  Bottom 1: v38.99,52.83 43.5,59.88 69.66,59.88 76.39,51.5 76.39,43.43 70.48,35.69 v66.99,35.62
N$40  (via drill 0.7)
  Top 0.3: IC2.25 60.71,37.15 62.23,38.67 62.23,39.94 IC2.1 | 37.21,47.24 C9.1
  Top 0.35: IC2.1 62.26,40.66 62.42,40.83 | 62.8,40.83 62.87,40.77
  Top 0.4: 38.04,46.86 C9.1
  Top 0.6: 62.42,40.83 62.8,40.83 | 62.87,40.77 C4.1 | 66.17,39.81 C3.1
  Top 0.8: L3.2 37.55,45.7 C9.1 | C4.1 64.4,39.38 66.17,39.81
  Top 1: v64.77,40.89 66.61,40.89 C3.1 | 38.04,46.86 39.5,46.86 v40.96,45.4
  Bottom 1: v40.96,45.4 61.02,45.59 v64.77,40.89
N$41
  Top 0.4: 8.45,54.8 U2.P$1
  Top 0.8: L1.2 C7.1 8.45,54.8
N$42
  cutout Route2: 0.19,63.88 0.38,63.88 0.44,35.94 35.49,35.94 arc90 39.49,39.95 39.44,59.32 arc90 35.44,63.31 0.19,63.31
ROMLOAD
  Top 0.4: U1.2 63.75,62.03 63.75,69.28 ARDUINO.TX3
SCK1
  Top 0.25: 57.72,39.95 IC2.8 | U1.5 58.42,65.24 58.42,58.93 60.64,56.71 60.64,54.55
  Top 0.3: 60.07,45.09 57.72,42.8 57.72,39.95
  Top 0.4: 60.07,45.09 62.93,45.09 65.66,47.69 65.66,52.64 62.55,52.64 60.64,54.55 53.09,54.55 R4.2
SDA1  (via drill 0.6)
  Top 0.25: R3.2 61.02,47.18
  Top 0.3: 61.02,47.18 57.02,43.18 57.02,42.42 IC2.9
  Top 0.4: U1.3 59.41,63.09 59.05,62.74 59.05,59.31 v64.14,54.61 | v64.2,48.58 R3.2
  Bottom 0.4: v64.14,54.61 v64.2,48.58
V_NAV
  Bottom 0.4: ARDUINO.A9 68.96,28.57 79.18,38.8 79.18,43.43 81.79,46.04 89.47,46.04 93.15,48.9 93.15,60.71 95.95,64.2 97.16,64.2 THUMB_CONTROLLER.V2
VCC
  Top 0.4: 15.3,29.72 17.34,29.72 | ARDUINO.3V3 28.38,24.45 28.38,22.8 26.48,20.89 22.8,20.89 22.1,24.96 | 89.92,74.58 THUMB_CONTROLLER.H1 | 48.7,53.85 48.7,62.36 57.66,71.31 58.99,71.31 | 58.99,71.31 60.2,71.31 62.67,69.09 62.67,64.71 61.98,64.26 60.98,64.26 U1.4 | 58.99,71.31 58.8,71.5 58.8,74.11 59.88,75.18 69.91,75.18 78.77,66.32 86.14,66.32 90.5,61.96 THUMB_CONTROLLER.V1
  Top 0.406: 28.38,24.45 28.38,30.1 48.7,50.42 48.7,53.85 | 86.14,66.32 THUMB_CONTROLLER.H1 | 15.3,29.72 13.72,29.78 11.75,31.69 11.43,31.69 C12.1 11.11,32.83 11.24,32.96 13.34,32.96 IC1.8 | 22.1,24.96 20.13,26.92 20.13,28.32 18.73,29.72 17.34,29.72
VIN
  Top 0.5: ARDUINO.VIN 38.48,19.81 29.21,10.54 21.78,10.54 20.07,12.26 14.73,12.26 12.51,10.03 6.35,10.03 2.67,13.72 2.67,60.83 7.43,64.2 7.37,64.14 7.49,64.33 7.49,65.02 | 7.49,65.02 7.49,67.56 IC3.3 | C10.1 7.3,65.22 7.49,65.02

### Text on the board
tPlace: oLED Display | TX | RX | AD5724RBREZ | . | IC2 | PULSE PAL | r2 | + | + | IC1 | + | + | + | + | + | Optoisolator | Input Ch1 | Input Ch2 | Output Ch1 | Output Ch2 | Output Ch3 | Output Ch4 | Open source pulse train generator